# Altium schematic sheet DAC_channel.SchDoc: =ProjectName
size 420 x 297 mm; Author: SBH; CompanyName: WUT; DrawnBy: SBH; Organization: ISE-WUT; Address1: Warsaw Univeristy of Technology; Address2: Nowowiejska 15/19; Revision: -; SheetNumber: -; SheetTotal: -; EDA_Number: ARTIQ; Projet: ADC/DAC MEZZANINE; ModifiedBy: -; CreateDate: XX/XX/XXXX; CheckedDate: -; Title2: DAC_channel.SchDoc; DivGrp: ISE; Designer: SBH; ModifiedDate: -; ProjectName: ADC/DAC MEZZANINE
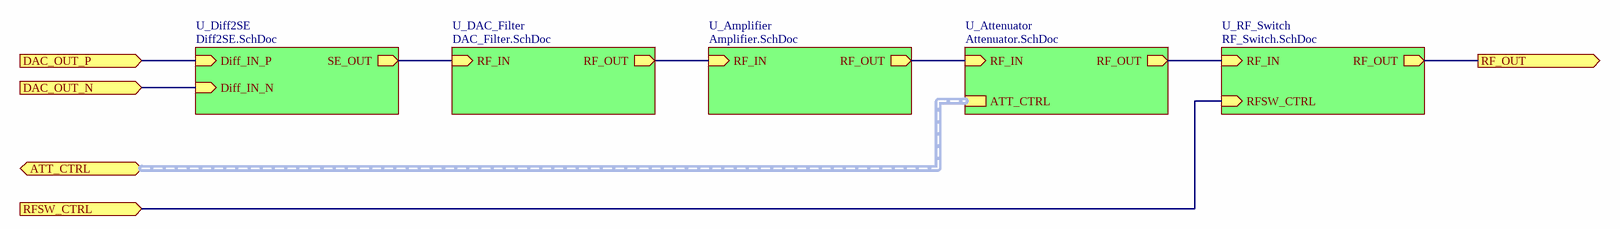
[diagram p0: DAC_channel.SchDoc]

## Sub-sheets
U_Amplifier = Amplifier.SchDoc: RF_IN (in), RF_OUT (out)
U_Attenuator = Attenuator.SchDoc: RF_IN (in), RF_OUT (out), ATT_CTRL (harness ATT_CTRL)
U_DAC_Filter = DAC_Filter.SchDoc: RF_IN (in), RF_OUT (out)
U_Diff2SE = Diff2SE.SchDoc: Diff_IN_P (in), Diff_IN_N (in), SE_OUT (out)
U_RF_Switch = RF_Switch.SchDoc: RF_IN (in), RF_OUT (out), RFSW_CTRL (in)

## Ports
ATT_CTRL (harness ATT_CTRL), DAC_OUT_N (in), DAC_OUT_P (in), RF_OUT (out), RFSW_CTRL (in)

## Nets
DAC_OUT_N: port DAC_OUT_N, sheet U_Diff2SE/Diff_IN_N
DAC_OUT_P: port DAC_OUT_P, sheet U_Diff2SE/Diff_IN_P
RF_OUT: port RF_OUT, sheet U_RF_Switch/RF_OUT
RFSW_CTRL: port RFSW_CTRL, sheet U_RF_Switch/RFSW_CTRL
(unnamed): sheet U_Diff2SE/SE_OUT, sheet U_DAC_Filter/RF_IN
(unnamed): sheet U_Amplifier/RF_IN, sheet U_DAC_Filter/RF_OUT
(unnamed): sheet U_Amplifier/RF_OUT, sheet U_Attenuator/RF_IN
(unnamed): sheet U_Attenuator/RF_OUT, sheet U_RF_Switch/RF_IN

## Buses and harness runs
harness port ATT_CTRL = sheet U_Attenuator/ATT_CTRL

## Notes on the sheet
- Project/Equipment
- Designer
- Drawn by
- Check.by
- File
- Last Mod.
- Print Date
- Sheet
- Size
- A3
- of
- Rev